# EAGLE design lipo (EAGLE 9.6.2)
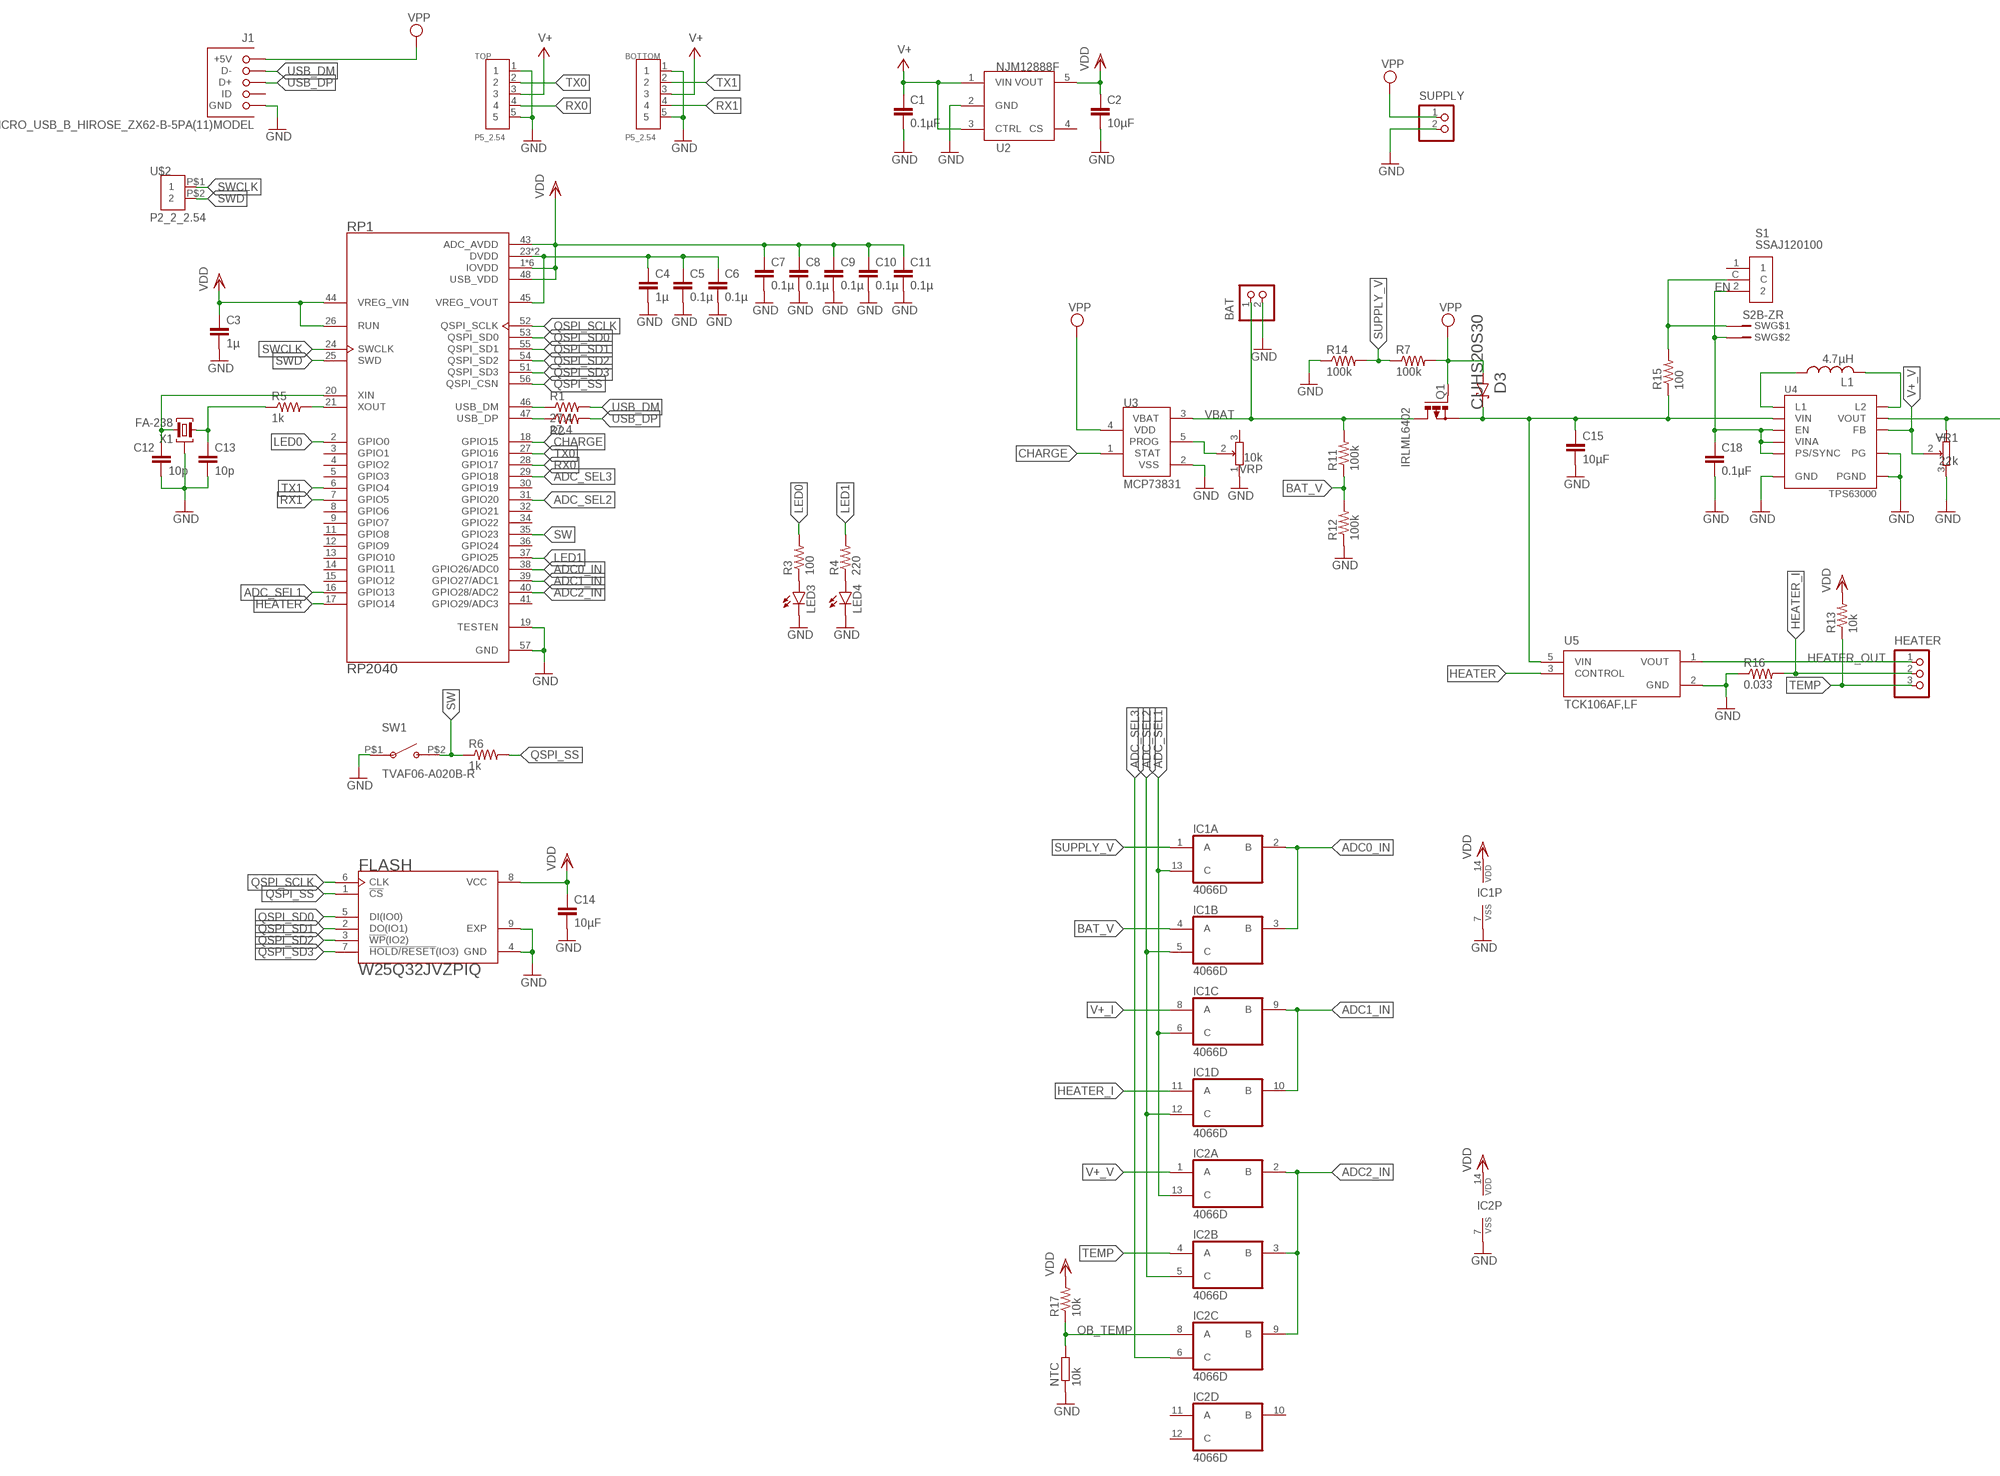
[diagram p0: schematic, sheet 1, part 1 of 2]
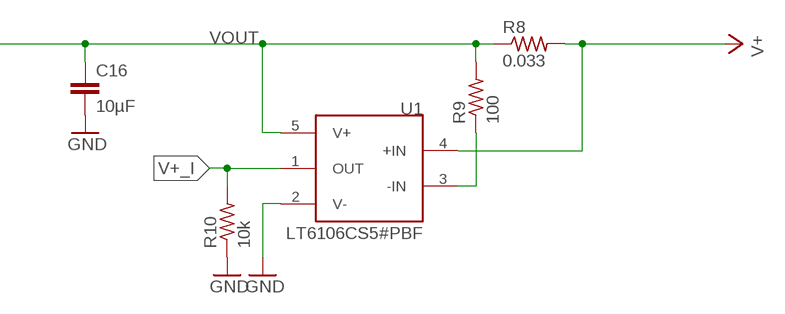
[diagram p1: schematic, sheet 1, part 2 of 2]

## Parts
BAT  S2B-PH-K-S  [S2B-PH-K-S]
BOTTOM  P5_2.54  [P5_2.54]
C1  0.1µF  C-EUC0402  [C0402]
C2  10µF  C-EUC0402  [C0402]
C3  1µ  C-EUC0402  [C0402]
C4  1µ  C-EUC0402  [C0402]
C5  0.1µ  C-EUC0402  [C0402]
C6  0.1µ  C-EUC0402  [C0402]
C7  0.1µ  C-EUC0402  [C0402]
C8  0.1µ  C-EUC0402  [C0402]
C9  0.1µ  C-EUC0402  [C0402]
C10  0.1µ  C-EUC0402  [C0402]
C11  0.1µ  C-EUC0402  [C0402]
C12  10p  C-EUC0402  [C0402]
C13  10p  C-EUC0402  [C0402]
C14  10µF  C-EUC0402  [C0402]
C15  10µF  C-EUC0402  [C0402]
C16  10µF  C-EUC0402  [C0402]
C18  0.1µF  C-EUC0402  [C0402]
D3  CUHS20S30  [CUHS20S30]
FLASH  W25Q32JVZPIQ  [SON127P600X500X80-9N]
HEATER  S3B-PH-K-S  [S3B-PH-K-S]
IC1  4066D  [SO14]
IC2  4066D  [SO14]
J1  MICRO_USB_B_HIROSE_ZX62-B-5PA(11)MODEL  [GHI-CONNECTORS_10118192-0001LF(MICRO-USB-B-AMPHENOL-FCI)]
L1  4.7µH  L-USL3225M  [L3225M]
LED3  LEDCHIPLED_0603  [CHIPLED_0603]
LED4  LEDCHIPLED_0603  [CHIPLED_0603]
NTC  10k  R-EU_R0603  [R0603]
Q1  IRLML6402  [SOT-23]
R1  27.4  R-US_R0402  [R0402]
R2  27.4  R-US_R0402  [R0402]
R3  100  R-US_R0402  [R0402]
R4  220  R-US_R0402  [R0402]
R5  1k  R-US_R0402  [R0402]
R6  1k  R-US_R0402  [R0402]
R7  100k  R-US_R0402  [R0402]
R8  0.033  R-US_R0603  [R0603]
R9  100  R-US_R0402  [R0402]
R10  10k  R-US_R0402  [R0402]
R11  100k  R-US_R0402  [R0402]
R12  100k  R-US_R0402  [R0402]
R13  10k  R-US_R0402  [R0402]
R14  100k  R-US_R0402  [R0402]
R15  100  R-US_R0402  [R0402]
R16  0.033  R-US_R0603  [R0603]
R17  10k  R-US_R0402  [R0402]
RP1  RP2040  [QFN40P700X700X90-57N]
S1  SSAJ120100  [SSAJ120100]
SUPPLY  S2B-PH-K-S  [S2B-PH-K-S]
SW  S2B-ZR  [S2B-ZR]
SW1  TVAF06-A020B-R  [TVAF06-A020B-R]
TOP  P5_2.54  [P5_2.54]
U1  LT6106CS5#PBF  [SOT95P280X100-5N_LT6106CS5#PBF]
U2  NJM12888F  [SOT95P240X110-5N]
U3  MCP73831  [SOT23-5L]
U4  TPS63000  [10-VFDFN]
U5  TCK106AF,LF  [IC_TCK106AF,LF]
U$2  P2_2_2.54  [P2_2.54]
VR1  22k  PVZ3A  [PVZ3A]
VRP  10k  PVZ3A  [PVZ3A]
X1  FA-238  [FA-238]

## Nets
1V2: C4.1 C5.1 C6.1 RP1.23(DVDD) RP1.45(VREG_VOUT) RP1.50(DVDD)
ADC0_IN: IC1.2(A:B) IC1.3(B:B) RP1.38(GPIO26/ADC0)
ADC1_IN: IC1.9(C:B) IC1.10(D:B) RP1.39(GPIO27/ADC1)
ADC2_IN: IC2.2(A:B) IC2.3(B:B) IC2.9(C:B) RP1.40(GPIO28/ADC2)
ADC_SEL1: IC1.6(C:C) IC1.13(A:C) IC2.13(A:C) RP1.16(GPIO13)
ADC_SEL2: IC1.5(B:C) IC1.12(D:C) IC2.5(B:C) RP1.31(GPIO20)
ADC_SEL3: IC2.6(C:C) RP1.29(GPIO18)
BAT_V: IC1.4(B:A) R11.1 R12.2
CHARGE: RP1.18(GPIO15) U3.1(STAT)
EN: C18.1 S1.2 SW.2 U4.6(EN) U4.7(PS/SYNC) U4.8(VINA)
GND: BAT.2 BOTTOM.1 BOTTOM.5 C1.2 C2.2 C3.2 C4.2 C5.2 C6.2 C7.2 C8.2 C9.2 C10.2 C11.2 C12.2 C13.2 C14.2 C15.2 C16.2 C18.2 FLASH.4(GND) FLASH.9(EXP) IC1.7(P:VSS) IC2.7(P:VSS) J1.CGND1(GND) J1.CGND2(GND) J1.CGND3(GND) J1.CGND4(GND) J1.CGND5(GND) J1.CGND6(GND) J1.GND LED3.C LED4.C NTC.1 R10.1 R12.1 R14.1 R16.1 RP1.19(TESTEN) RP1.57(GND) SUPPLY.2 SW1.P$1(A) TOP.1 TOP.5 U1.2(V-) U2.2(GND) U3.2(VSS) U4.3(PGND) U4.9(GND) U4.P$1(PG) U4.P$2(PG) U4.P$3(PG) U4.P$4(PG) U4.P$5(PG) U5.2(GND) VR1.3 VRP.1 X1.2(G) X1.4(G)
HEATER: RP1.17(GPIO14) U5.3(CONTROL)
HEATER_I: HEATER.2 IC1.11(D:A) R16.2
HEATER_OUT: HEATER.1 U5.1(VOUT)
LED0: R3.2 RP1.2(GPIO0)
LED1: R4.2 RP1.37(GPIO25)
N$1: L1.1 U4.4(L1)
N$2: R9.1 U1.3(-IN)
N$4: U3.5(PROG) VRP.2
N$7: L1.2 U4.2(L2)
N$8: LED3.A R3.1
N$9: LED4.A R4.1
N$11: C13.1 R5.1 X1.1
N$14: R15.2 S1.C SW.1
OB_TEMP: IC2.8(C:A) NTC.2 R17.1
QSPI_SCLK: FLASH.6(CLK) RP1.52(QSPI_SCLK)
QSPI_SD0: FLASH.5(DI(IO0)) RP1.53(QSPI_SD0)
QSPI_SD1: FLASH.2(DO(IO1)) RP1.55(QSPI_SD1)
QSPI_SD2: FLASH.3(!WP!(IO2)) RP1.54(QSPI_SD2)
QSPI_SD3: FLASH.7(!HOLD/RESET!(IO3)) RP1.51(QSPI_SD3)
QSPI_SS: FLASH.1(!CS) R6.2 RP1.56(QSPI_CSN)
RX0: RP1.28(GPIO17) TOP.4
RX1: BOTTOM.4 RP1.7(GPIO5)
SUPPLY_V: IC1.1(A:A) R7.1 R14.2
SW: R6.1 RP1.35(GPIO23) SW1.P$2(B)
SWCLK: RP1.24(SWCLK) U$2.P$1
SWD: RP1.25(SWD) U$2.P$2
TEMP: HEATER.3 IC2.4(B:A) R13.1
TX0: RP1.27(GPIO16) TOP.2
TX1: BOTTOM.2 RP1.6(GPIO4)
USB_DM: J1.D- R1.2
USB_DM_1: R1.1 RP1.46(USB_DM)
USB_DP: J1.D+ R2.2
USB_DP_1: R2.1 RP1.47(USB_DP)
V+: BOTTOM.3 C1.1 R8.2 TOP.3 U1.4(+IN) U2.1(VIN) U2.3(CTRL)
V+_I: IC1.8(C:A) R10.2 U1.1(OUT)
V+_V: IC2.1(A:A) U4.10(FB) VR1.2
VBAT: BAT.1 Q1.P3(D) R11.2 U3.3(VBAT)
VBAT_: C15.1 D3.C Q1.P2(S) R15.1 U4.5(VIN) U5.5(VIN)
VDD: C2.1 C3.1 C7.1 C8.1 C9.1 C10.1 C11.1 C14.1 FLASH.8(VCC) IC1.14(P:VDD) IC2.14(P:VDD) R13.2 R17.2 RP1.1(IOVDD) RP1.10(IOVDD) RP1.22(IOVDD) RP1.26(RUN) RP1.33(IOVDD) RP1.42(IOVDD) RP1.43(ADC_AVDD) RP1.44(VREG_VIN) RP1.48(USB_VDD) RP1.49(IOVDD) U2.5(VOUT)
VOUT: C16.1 R8.1 R9.2 U1.5(V+) U4.1(VOUT) VR1.1
VPP: D3.A J1.VBUS(+5V) Q1.P1(G) R7.2 SUPPLY.1 U3.4(VDD)
XIN1: C12.1 RP1.20(XIN) X1.3
XOUT1: R5.2 RP1.21(XOUT)
Unconnected: IC2.10(D:B) IC2.11(D:A) IC2.12(D:C) J1.ID RP1.3(GPIO1) RP1.4(GPIO2) RP1.5(GPIO3) RP1.8(GPIO6) RP1.9(GPIO7) RP1.11(GPIO8) RP1.12(GPIO9) RP1.13(GPIO10) RP1.14(GPIO11) RP1.15(GPIO12) RP1.30(GPIO19) RP1.32(GPIO21) RP1.34(GPIO22) RP1.36(GPIO24) RP1.41(GPIO29/ADC3) S1.1 U2.4(CS) VRP.3

## Library data of the parts
BAT SUPPLY = jst-ph:S2B-PH-*: Wire-to-Board 2.0mm pitch side mount connector Source: http://www.jst-mfg.com/product/pdf/jpn/PH.pdf http://www.jst-mfg.com/product/detail.php?series=199
BOTTOM TOP = pins:P5_2.54
C1-C16 C18 = rcl:C-EU: CAPACITOR, European symbol; SPICEPREFIX: C
D3 = diodes:CUHS20S30
FLASH = W25Q32JVZPIQ:W25Q32JVZPIQ: Serial Flash Memory With Dual, Quad Spi Check availability <https://pricing.snapeda.com/parts/W25Q32JVZPIQ/Winbond/view-part?ref=eda>; AVAILABILITY: In Stock; DESCRIPTION: FLASH - NOR Memory IC 32Mb (4M x 8) SPI - Quad I/O 133 MHz 8-WSON (6x5); MF: Winbond; MP: W25Q32JVZPIQ; PACKAGE: WSON-8 Winbond; PRICE: None; PURCHASE-URL: https://pricing.snapeda.com/search/part/W25Q32JVZPIQ/?ref=eda
HEATER = jst-ph:S3B-PH-*: Wire-to-Board 2.0mm pitch side mount connector Source: http://www.jst-mfg.com/product/pdf/jpn/PH.pdf http://www.jst-mfg.com/product/detail.php?series=199
IC1 IC2 = 40xx:4066: Quad bilateral ANALOG SWITCH
J1 = connector:MICRO_USB_B_HIROSE_ZX62-B-5PA(11): Connector Receptacle USB - micro B 2.0 5 Position Surface Mount, Right Angle, Horizontal Bottom Mount
L1 = rcl:L-US: INDUCTOR, American symbol; SPICEPREFIX: L
LED3 LED4 = led:LED: LED OSRAM: - CHIPLED LG R971, LG N971, LY N971, LG Q971, LY Q971, LO R971, LY R971 LH N974, LH R974 LS Q976, LO Q976, LY Q976 LO Q996 - Hyper CHIPLED LW Q18S LB Q993, LB Q99A, LB R99A - SideLED LS A670, LO A670, LY A670, LG A670, LP A670 LB A673, LV A673, LT A673, LW A673 LH A674 LY A675 LS A676, LA A676, LO A676, LY A676, LW A676 LS A679, LY A679, LG A679 - Hyper Micro SIDELED® LS Y876, LA Y876, LO Y876, LY Y876 LT Y87S - SmartLED LW L88C, LW L88S LB L89C, LB L89S, LG L890 LS L89K, LO L89K, LY L89K LS L896, LA L896, LO L896, LY L896 - TOPLED LS T670, LO T670, LY T670, LG T670, LP T670 LSG T670, LSP T670, LSY T670, LOP T670, LYG T670 LG T671, LOG T671, LSG T671 LB T673, LV T673, LT T673, LW T673 LH T674 LS T676, LA T676, LO T676, LY T676, LB T676, LH T676, LSB T676, LW T676 LB T67C, LV T67C, LT T67C, LS T67K, LO T67K, LY T67K, LW E67C LS E67B, LA E67B, LO E67B, LY E67B, LB E67C, LV E67C, LT E67C LW T67C LS T679, LY T679, LG T679 LS T770, LO T770, LY T770, LG T770, LP T770 LB T773, LV T773, LT T773, LW T773 LH T774 LS E675, LA E675, LY E675, LS T675 LS T776, LA T776, LO T776, LY T776, LB T776 LHGB T686 LT T68C, LB T68C - Hyper Mini TOPLED® LB M676 - Mini TOPLED Santana® LG M470 LS M47K, LO M47K, LY M47K Source: http://www.osram.convergy.de LUXEON: - LUMILED® LXK2-PW12-R00, LXK2-PW12-S00, LXK2-PW14-U00, LXK2-PW14-V00 LXK2-PM12-R00, LXK2-PM12-S00, LXK2-PM14-U00 LXK2-PE12-Q00, LXK2-PE12-R00, LXK2-PE12-S00, LXK2-PE14-T00, LXK2-PE14-U00 LXK2-PB12-K00, LXK2-PB12-L00, LXK2-PB12-M00, LXK2-PB14-N00, LXK2-PB14-P00, LXK2-PB14-Q00 LXK2-PR12-L00, LXK2-PR12-M00, LXK2-PR14-Q00, LXK2-PR14-R00 LXK2-PD12-Q00, LXK2-PD12-R00, LXK2-PD12-S00 LXK2-PH12-R00, LXK2-PH12-S00 LXK2-PL12-P00, LXK2-PL12-Q00, LXK2-PL12-R00 Source: www.luxeon.com KINGBRIGHT: KA-3528ASYC Source: www.kingbright.com
NTC = rcl:R-EU_: RESISTOR, European symbol; SPICEPREFIX: R
Q1 = mosfet:IRLML6402: Pch MOSFET IRLML6402 20V 3.7A http://akizukidenshi.com/catalog/g/gI-02553/ I-02553
R1-R17 = rcl:R-US_: RESISTOR, American symbol; SPICEPREFIX: R
RP1 = RP2040:RP2040: Check availability <https://pricing.snapeda.com/parts/RP2040/Raspberry%20Pi/view-part?ref=eda>; AVAILABILITY: In Stock; DESCRIPTION: RP2040 chip for Raspberry Pi Pico - ARM® Cortex®-M0+ MCU 32-Bit; MF: Raspberry Pi; MP: RP2040; PACKAGE: None; PRICE: None; PURCHASE-URL: https://pricing.snapeda.com/search/part/RP2040/?ref=eda
S1 = SSAJ120100:SSAJ120100: Slide Switches 1-pole 2-positions Surface Mount Slide Switch SPDT Maintained 10 mA Slide Source: Datasheet <http://www.farnell.com/datasheets/1582290.pdf>; DESCRIPTION: Slide Switches 1-pole 2-positions Surface Mount Slide Switch SPDT Maintained 10 mA Slide; HEIGHT: mm; MANUFACTURER_NAME: ALPS; MANUFACTURER_PART_NUMBER: SSAJ120100; MOUSER_PART_NUMBER: 688-SSAJ120100; MOUSER_PRICE-STOCK: https://www.mouser.com/Search/Refine.aspx?Keyword=688-SSAJ120100; RS_PART_NUMBER: 1238892; RS_PRICE-STOCK: http://uk.rs-online.com/web/p/products/1238892
SW = con-jst-zh:S2B-ZR
SW1 = switches:TVAF06-A020B-R
U1 = LT6106CS5_PBF:LT6106CS5#PBF: IC OPAMP CURR SENSE TSOT23-5 Check availability <https://pricing.snapeda.com/parts/LT6106CS5%23PBF/Linear%20Technology/view-part?ref=eda>; AVAILABILITY: Not in stock; DESCRIPTION: LT6106 - Low Cost, 36V High Side Current Sense Amplifier; MF: Linear Technology; MP: LT6106CS5#PBF; PACKAGE: TSOT-23 Linear Technology; PRICE: None
U2 = regulators:NJM12888F
U3 = mcp73831:MCP73831: Miniature Single-Cell, Fully Integrated Li-Ion, Li-Polymer Charge Management Controllers
U4 = TPS63000:TPS63000: Check availability <https://pricing.snapeda.com/parts/TPS63000/Texas%20Instruments/view-part?ref=eda>; AVAILABILITY: Not in stock; DESCRIPTION: TPS63000 DC to DC Converter and Switching Regulator Chip 3.2VDC to 3.4VDC Output Evaluation Board; MF: Texas Instruments; MP: TPS63000; PACKAGE: VFDFN-10 Texas Instruments; PRICE: None
U5 = TCK106AF_LF:TCK106AF,LF: Power Switch/Driver 1:1 P-Channel 1A 5-SMV, SOT-25, SC-74A Check availability <https://pricing.snapeda.com/parts/TCK106AF%2CLF/Toshiba%20Semiconductor/view-part?ref=eda>; AVAILABILITY: In Stock; DESCRIPTION: Power Switch/Driver 1:1 P-Channel 1A 5-SMV, SOT-25, SC-74A; MF: Toshiba Semiconductor; MP: TCK106AF,LF; PACKAGE: SOT-753 Toshiba Semiconductor; PRICE: None; PURCHASE-URL: https://pricing.snapeda.com/search/part/TCK106AF,LF/?ref=eda
U$2 = pins:P2_2_2.54
VR1 VRP = potentiometers:PVZ3A
X1 = crystal':FA-238: CRYSTAL

## Board
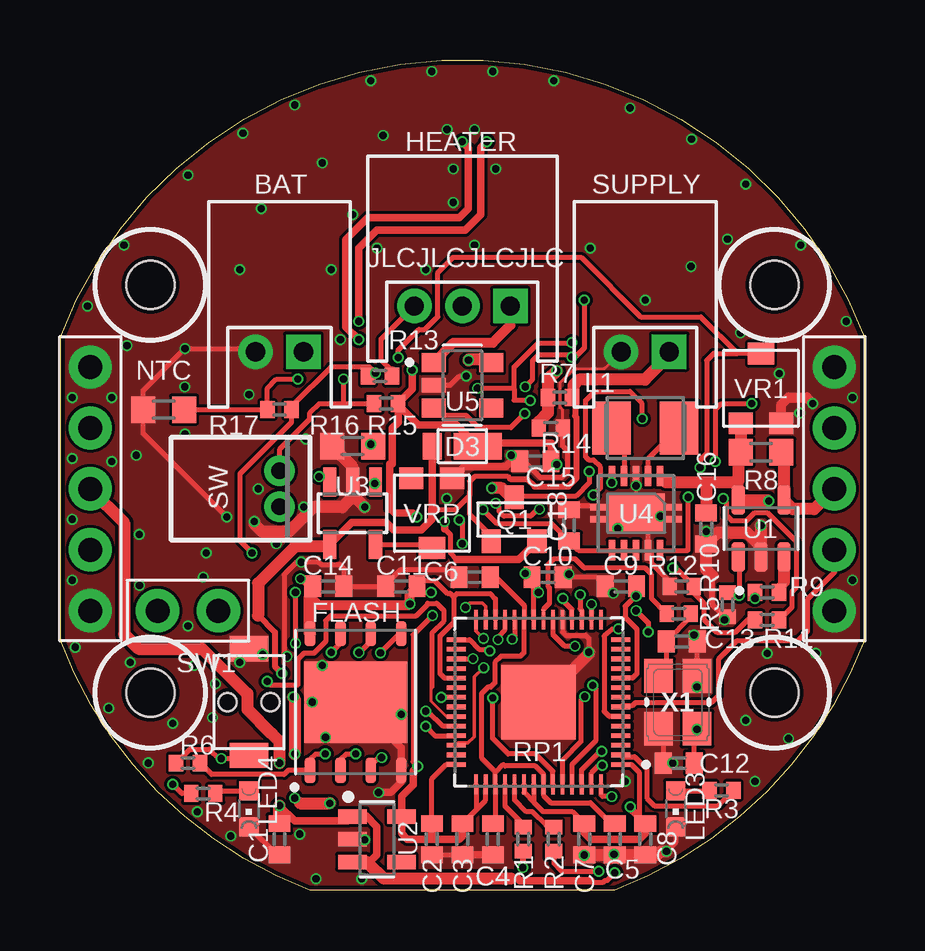
[diagram p2: board, top side]
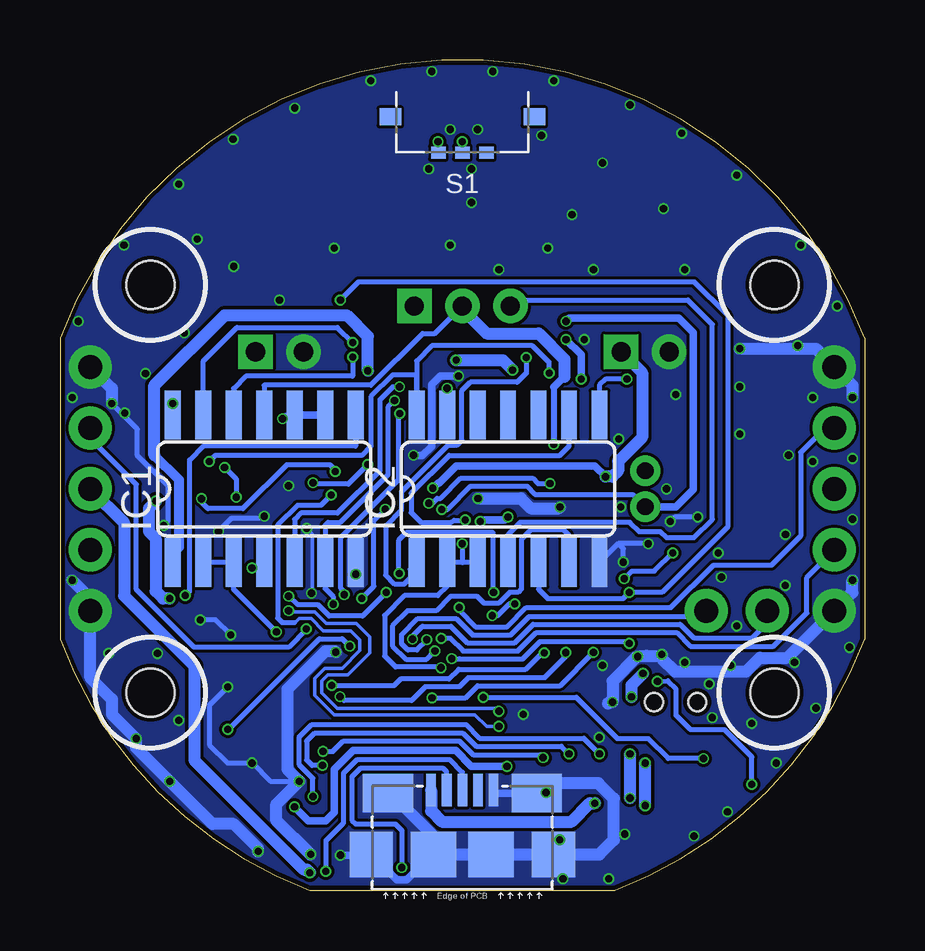
[diagram p3: board, bottom side, seen from below]

Size 33.53 x 34.61 mm. Coordinates in mm from the lower left corner, seen from the top.
Outline: 33.53,23.01 33.53,10.46 arc-49 23.11,0 10.41,0 arc-49 0,10.46 0,23.01 arc-139 33.53,23.01
Copper layers (1*16): Top 0.035mm / dielectric 1mm / Bottom 0.035mm
Design rules "jlcpcb-2layers-1.0mm": minimum track width 5mil, minimum drill 0.3mm, track to track 5mil, track to pad 5mil, pad to pad 5mil, via to via 5mil, smd to smd 5mil, copper to edge 0.2mm, drill to drill 6mil, minimum pad ring 10mil, minimum via ring 3mil, stop-mask expansion 4mil, vias tented up to drill 1mm, thermal gap 10mil
Holes 2 mm at 29.76,25.24 29.76,8.24 3.76,25.24 3.76,8.24

### Footprints (pad centres in the part's own frame; a part is rotated, then mirrored left to right if it is on the bottom)
S2B-PH-K-S = drill 0.8 square: 1 1,0 | drill 0.8: 2 -1,0
P5_2.54 = drill 1: 1 0,5.08; 2 0,2.54; 3 0,0; 4 0,-2.54; 5 0,-5.08
C0402 = smd 0.7 x 0.9: 1 -0.65,0; 2 0.65,0
CUHS20S30 = smd 0.8 x 1.1: A 1.25,0 | smd 2 x 1.1: C -0.65,0
SON127P600X500X80-9N = smd 1.04 x 0.44: 1 -2.845,1.905; 2 -2.845,0.635; 3 -2.845,-0.635; 4 -2.845,-1.905; 5 2.845,-1.905; 6 2.845,-0.635; 7 2.845,0.635; 8 2.845,1.905 | smd 3.4 x 4.3: 9 0,0
S3B-PH-K-S = drill 0.8 square: 1 2,0 | drill 0.8: 2 0,0; 3 -2,0
SO14 = smd 0.66 x 2.032: 1 -3.81,-3.073; 2 -2.54,-3.073; 3 -1.27,-3.073; 4 0,-3.073; 5 1.27,-3.073; 6 2.54,-3.073; 7 3.81,-3.073; 8 3.81,3.073; 9 2.54,3.073; 10 1.27,3.073; 11 0,3.073; 12 -1.27,3.073; 13 -2.54,3.073; 14 -3.81,3.073
GHI-CONNECTORS_10118192-0001LF(MICRO-USB-B-AMPHENOL-FCI) = smd 1.8 x 1.9: CGND1 -3.8,0; CGND4 3.8,0 | smd 1.9 x 1.9: CGND2 -1.2,0; CGND3 1.2,0 | smd 2.1 x 1.6: CGND5 3.1,2.55; CGND6 -3.1,2.55 | smd 0.4 x 1.35: D+ 0,2.675; D- -0.65,2.675; GND 1.3,2.675; ID 0.65,2.675; VBUS -1.3,2.675
L3225M = smd 1.6 x 2.2: 1 -1.4,0; 2 1.4,0
CHIPLED_0603 = smd 0.8 x 0.8: A 0,-0.75; C 0,0.75
R0603 = smd 1 x 1.1: 1 -0.85,0; 2 0.85,0
SOT-23 = smd 0.802 x 0.972: P1 -0.95,-0.917; P2 0.95,-0.917; P3 0,0.917
R0402 = smd 0.6 x 0.7: 1 -0.5,0; 2 0.5,0
QFN40P700X700X90-57N = smd 0.84 x 0.2: 1 -3.435,2.6; 2 -3.435,2.2; 3 -3.435,1.8; 4 -3.435,1.4; 5 -3.435,1; 6 -3.435,0.6; 7 -3.435,0.2; 8 -3.435,-0.2; 9 -3.435,-0.6; 10 -3.435,-1; 11 -3.435,-1.4; 12 -3.435,-1.8; 13 -3.435,-2.2; 14 -3.435,-2.6; 29 3.435,-2.6; 30 3.435,-2.2; 31 3.435,-1.8; 32 3.435,-1.4; 33 3.435,-1; 34 3.435,-0.6; 35 3.435,-0.2; 36 3.435,0.2; 37 3.435,0.6; 38 3.435,1; 39 3.435,1.4; 40 3.435,1.8; 41 3.435,2.2; 42 3.435,2.6 | smd 0.2 x 0.84: 15 -2.6,-3.435; 16 -2.2,-3.435; 17 -1.8,-3.435; 18 -1.4,-3.435; 19 -1,-3.435; 20 -0.6,-3.435; 21 -0.2,-3.435; 22 0.2,-3.435; 23 0.6,-3.435; 24 1,-3.435; 25 1.4,-3.435; 26 1.8,-3.435; 27 2.2,-3.435; 28 2.6,-3.435; 43 2.6,3.435; 44 2.2,3.435; 45 1.8,3.435; 46 1.4,3.435; 47 1,3.435; 48 0.6,3.435; 49 0.2,3.435; 50 -0.2,3.435; 51 -0.6,3.435; 52 -1,3.435; 53 -1.4,3.435; 54 -1.8,3.435; 55 -2.2,3.435; 56 -2.6,3.435 | smd 3.1 x 3.1: 57 0,0
SSAJ120100 = smd 0.6 x 0.51: 1 -1,2.5; 2 1,2.5; C 0,2.5 | smd 0.9 x 0.7: GND@1 -3,1; GND@2 3,1
S2B-ZR = drill 0.7 pad 1.1: 1 -0.75,0; 2 0.75,0
TVAF06-A020B-R = smd 1.6 x 1.05: P$1 0,2.225; P$2 0,-2.225 | hole 0.75: -0.9,0; 0.9,0
SOT95P280X100-5N_LT6106CS5#PBF = smd 1.24 x 0.55: 1 -1.185,0.95; 2 -1.185,0; 3 -1.185,-0.95; 4 1.185,-0.95; 5 1.185,0.95
SOT95P240X110-5N = smd 1.18 x 0.609: 1 -1.024,0.95; 2 -1.024,0; 3 -1.024,-0.95; 4 1.024,-0.95; 5 1.024,0.95
SOT23-5L = smd 0.533 x 1.2: 1 -0.95,-1.3; 2 0,-1.3; 3 0.95,-1.3 | smd 0.55 x 1.2: 4 0.95,1.3; 5 -0.95,1.3
10-VFDFN = smd 0.85 x 0.28: 1 -1.55,1; 2 -1.55,0.5; 3 -1.55,0; 4 -1.55,-0.5; 5 -1.55,-1; 6 1.55,-1; 7 1.55,-0.5; 8 1.55,0; 9 1.55,0.5; 10 1.55,1 | smd 1.65 x 2.4: P$1 0,0 | smd 0.28 x 0.7: P$2 -0.25,1.55; P$3 0.25,1.55; P$4 -0.25,-1.55; P$5 0.25,-1.55
IC_TCK106AF,LF = smd 1 x 0.8: 1 -1.2,0.95; 3 -1.2,-0.95; 4 1.2,-0.95; 5 1.2,0.95 | smd 1 x 0.6: 2 -1.2,0
P2_2.54 = drill 1: P$1 0,1.27; P$2 0,-1.27
PVZ3A = smd 1 x 0.9: 1 -0.85,-1.45; 3 0.85,-1.45 | smd 1.1 x 0.9: 2 0,1.45
FA-238 = smd 1.4 x 1.2: 1 -1.1,-0.8; 2 1.1,-0.8; 3 1.1,0.8; 4 -1.1,0.8

### Placement (x,y rotation side)
BAT  9.14,22.45 0 top
BOTTOM  32.26,16.74 0 top
C1  9.14,2.13 270 top
C2  15.49,2.13 270 top
C3  16.76,2.13 270 top
C4  18.03,2.13 270 top
C5  23.11,2.13 270 top
C6  17.27,13.05 180 top
C7  21.84,2.13 270 top
C8  24.38,2.13 270 top
C9  23.37,12.67 180 top
C10  20.32,13.05 0 top
C11  14.22,12.67 180 top
C12  25.78,5.31 180 top
C13  25.91,10.37 0 top
C14  11.18,12.67 0 top
C15  19.81,17.88 180 top
C16  26.92,15.08 270 top
C18  21.21,15.21 90 top
D3  16.76,18.51 180 top
FLASH  12.32,7.85 90 top
HEATER  16.76,24.36 0 top
IC1  25.02,16.74 0 bottom
IC2  14.86,16.74 0 bottom
J1  16.76,1.5 0 bottom
L1  24.38,19.28 0 top
LED3  25.65,3.4 180 top
LED4  7.87,3.4 180 top
NTC  4.32,20.04 0 top
Q1  18.92,15.47 0 top
R1  19.3,2.13 270 top
R2  20.57,2.13 270 top
R3  27.56,4.16 0 top
R4  5.97,4.04 180 top
R5  25.78,11.53 180 top
R6  5.33,5.31 0 top
R7  20.83,20.55 0 top
R8  29.21,18.26 0 top
R9  29.46,12.42 180 top
R10  27.81,11.91 90 top
R11  29.46,11.27 0 top
R12  25.91,12.67 0 top
R13  13.33,21.43 180 top
R14  20.45,19.28 180 top
R15  13.59,20.29 180 top
R16  12.19,18.51 0 top
R17  9.14,20.04 0 top
RP1  19.94,7.85 180 top
S1  16.76,33.25 180 bottom
SUPPLY  24.38,22.45 0 top
SW  9.14,16.74 270 top
SW1  7.87,7.85 0 top
TOP  1.26,16.74 0 top
U1  29.21,15.08 90 top
U2  13.21,2.13 0 top
U3  12.19,15.72 180 top
U4  24,15.72 270 top
U5  16.76,21.05 0 top
U$2  5.33,11.66 90 top
VR1  29.21,20.93 0 top
VRP  15.49,15.72 180 top
X1  25.74,7.84 270 top

### Tracks (layer width: path | path; a pad name or v marks a point on that pad's centre or on a via)
1V2
  Top 0.2: C4.1 18.14,2.89 RP1.45 18.14,4.9 18.16,4.92 | C5.1 22.97,2.78 22.1,3.65 20.45,3.65 20.14,3.96 RP1.50 20.14,4.85 19.81,5.18 18.54,5.18 18.48,5.24 18.16,4.92 | 18.16,4.92 17.56,5.53 17.56,8.2 17.84,8.48 17.96,8.48 18.12,8.64 18.12,9.49 18.38,9.75 19.18,9.75 19.34,9.91 RP1.23 19.34,11.88 18.16,13.05 C6.1
ADC0_IN  (via drill 0.3)
  Top 0.127: v24,11.66 24.13,11.53
  Top 0.2: 24.13,11.53 24.51,11.15 v24.51,10.77 | RP1.38 15.94,6.86 15.33,7.46 v15.24,7.46
  Bottom 0.15: v24,11.66 23.95,11.6 22.92,11.6 22.44,11.13 21.19,11.13 20.62,10.56
  Bottom 0.152: v15.24,7.46 15.37,7.59 21.98,7.59 22.63,8.24 22.63,8.72 22.38,8.98 21.54,8.98 20.62,9.9 20.62,10.56
  Bottom 0.2: IC1.2 IC1.3 26.29,12.54 v24.51,10.77
ADC1_IN  (via drill 0.3, 0.3 pad 0.2)
  Top 0.2: v22.23,16.48 22.53,16.79 22.53,17.64 22.23,17.94 22.04,17.94 21.91,18.07 21.91,20.42 22.29,20.8 23.75,20.8 24.26,20.29 v24.26,19.66 | v15.24,6.83 15.62,6.45 RP1.39
  Bottom 0.15: 23.75,11.15 23.57,11.33 23.06,11.33 22.55,10.81 21.41,10.81
  Bottom 0.152: v15.24,6.83 15.76,6.83 16.24,7.31 22.1,7.31 22.91,8.12 22.91,8.84 22.49,9.26 21.77,9.26 21.03,10 21.03,10.43 21.41,10.81
  Bottom 0.2: IC1.10 24.11,19.81 v24.26,19.66 | 23.75,11.15 24.26,11.15 24.46,11.35 24.46,15.22 23.63,16.05 22.66,16.05 v22.23,16.48
  Bottom 0.305: IC1.9 IC1.10
ADC2_IN  (via drill 0.3)
  Top 0.152: RP1.40 16.6,6.14 16.99,6.14 17.25,6.4 17.25,8.9 17.27,8.9 v17.65,9.28
  Top 0.2: v16.64,15.44 16.76,15.31 v16.76,14.45
  Bottom 0.2: IC2.3 16.76,13.66 | 16.76,13.66 IC2.2 | 17.4,13.01 IC2.2 | v17.65,9.28 17.68,9.3 19.54,9.3 20,9.76 20,11.47 19.18,12.29 17.78,12.29 17.4,12.67 IC2.2 | v16.64,15.44 16.66,15.42 17.11,15.42 17.23,15.34 18.48,15.34 18.89,15.75 18.89,16.55 17.31,18.13 12.7,18.13 12.32,18.51 IC2.9 | v16.76,14.45 16.76,13.66
ADC_SEL1  (via drill 0.3)
  Top 0.2: 18.92,20.93 v17.4,20.93 | 18.92,20.93 18.92,21.82 19.91,22.8 21.31,22.8 v21.34,22.83 | 18.92,20.93 18.92,20.42 v19.59,20.42 | v22.15,11.92 22.13,11.92 22.13,11.29 RP1.16
  Bottom 0.2: IC1.13 27.56,22.07 26.16,23.47 21.97,23.47 v21.34,22.83 | v17.4,20.93 IC2.13 | v22.15,11.92 22.15,12.24 22.48,12.58 IC1.6 22.48,15.21 22.35,15.34 21.84,15.34 19.87,17.32 19.87,20.14 v19.59,20.42
ADC_SEL2  (via drill 0.3)
  Top 0.2: v21.84,24.61 21.84,22.61 21.46,22.23 v21.34,22.23 v21.33,22.23 21.24,22.32 19.94,22.32 19.68,22.07 19.68,21.29 v19.38,20.99 | RP1.31 17.2,9.65 v17.21,9.66 | v9.81,12.42 v9.81,10.29
  Bottom 0.2: v21.34,22.23 21.34,21.44 21.34,21.43 25.78,21.43 26.29,20.93 IC1.12 | v19.38,20.99 19.66,20.99 20.19,20.46 20.19,17.5 21.97,15.72 23.49,15.72 23.75,15.47 IC1.5 | IC2.5 13.59,12.54 13.21,12.16 10.06,12.16 v9.81,12.42 8.44,12.42 5.71,15.14 5.71,23.97 7.11,25.37 21.08,25.37 v21.84,24.61 | v17.21,9.66 16.88,9.66 16.87,9.65 14.25,9.65 13.53,10.37 9.89,10.37 v9.81,10.29
ADC_SEL3  (via drill 0.3)
  Top 0.2: v17.91,9.97 17.83,10.05 17.46,10.05 17.06,10.45 RP1.29
  Bottom 0.2: IC2.6 12.32,14.79 12.54,15.01 13.92,15.01 14.3,14.63 14.3,12.55 14.43,12.42 14.79,12.42 15.25,11.96 15.86,11.96 16.14,12.24 17.28,12.24 17.86,11.66 19.04,11.66 19.68,11.02 19.68,10.2 19.11,9.63 18.25,9.63 v17.91,9.97
BAT_V  (via drill 0.3)
  Top 0.2: v25.53,13.43 25.65,13.43 R12.2 26.41,12.39 26.82,11.97 26.82,11.3 27.37,10.76 28.13,10.76 28.65,11.27 R11.1
  Bottom 0.2: IC1.4 25.25,13.43 v25.53,13.43
CHARGE  (via drill 0.3)
  Top 0.2: RP1.18 21.33,11.29 21.33,11.72 20.95,12.09 v20.95,12.16 | v19.98,15.88 19.89,15.88 19.61,15.6 18.49,15.6 18.29,15.8 18.29,15.98 18.16,16.11 v18.16,16.13 | U3.1 13.11,16.99 v13.11,16.95
  Bottom 0.2: v20.95,12.16 20.45,12.67 20.45,15.41 v19.98,15.88 | v18.16,16.13 18.01,16.13 17.81,16.33 17.67,16.33 16.83,17.18 13.84,17.18 13.62,16.95 v13.11,16.95
EN  (via drill 0.3)
  Top 0.2: U4.8 U4.7 U4.6 21.6,14.17 C18.1 20.49,15.28 18.22,15.28 v17.62,15.88
  Top 0.305: v12.45,23.72 12.45,26.77 13.21,27.53 16.89,27.53 17.53,28.17 17.53,30.96 v17.78,31.21
  Bottom 0.2: v17.78,31.21 17.78,30.76 S1.2 | v17.62,15.88 17.38,15.88 16.41,16.84 14.07,16.84 13.72,16.49 9.65,16.49 SW.2
  Bottom 0.305: SW.2 7.86,15.99 7.14,16.7 7.14,23.25 7.75,23.85 12.32,23.85 v12.45,23.72
GND  (via drill 0.3)
  Top 0.127: VRP.1 16.11,17.41 | R14.1 20.95,20.01 20.84,20.12 20.84,21.16 21.43,21.76 22.69,21.76 SUPPLY.2 | U3.2 12.19,16.48 | RP1.57 21.23,9.14 21.31,9.14
  Top 0.15: C9.2 23,12.39 v23.05,12.39 | U4.P$1 23.88,15.72 v23.24,15.08
  Top 0.152: U4.3 24,15.59 | U4.P$1 U4.3 | v24,16.86 U4.3 | 27.75,11.47 R10.1 v27.69,11.27 | C4.2 17.78,1.48
  Top 0.2: v21.21,13.18 21.1,13.18 C10.2 22.34,13.05 C9.2 | C6.2 16.38,13.05 16.08,13.35 14.18,13.35 13.57,12.75 C11.2 C14.2 11.83,13.42 11.65,13.59 10.87,13.59 10.79,13.68 v10.05,13.68 10.03,13.66 9.83,13.66 9.33,13.16 9.33,9.87 v9.46,9.74 | SW1.P$1 8.11,9.83 v8.45,9.83 | LED4.C 9.04,1.48 C1.2 | LED3.C 25.65,2 v25.27,1.62 | X1.2 25.13,6.55 C12.2 v25.53,5.31 | v26.54,8.48 X1.4 26.54,10.37 C13.2 26.42,10.53 v26.42,10.64 | RP1.19 20.94,10.76 21.07,10.63 21.9,10.63 22.04,10.5 v22.04,9.93 | R16.1 11.34,18.49 | C18.2 21.38,16.03 22.39,16.03 U4.P$4 23.88,15.97 24.13,15.72 | v25.02,15.59 24.89,15.72 24.13,15.72 | 24.13,15.72 U4.P$1 | U4.P$1 24.5,15.22 U4.9 24.64,14.04 24.64,13.65 25.41,12.88 R12.1 | 29.21,14.32 U1.2 | U4.P$5 23.88,15.47 24,15.59 24.13,15.72 | U4.P$2 24.25,15.97 U4.P$1 | U4.P$3 24.25,15.47 U4.P$1 | C5.2 23.09,1.48 v23.08,1.49 | U5.2 16.26,21.05 16.64,21.44 v16.93,21.44 | v18.8,18.13 18.8,18.08 18.78,18.06 18.78,17.88 | C15.2 19.34,17.88 20.02,17.2 20.91,17.2 21.15,17.45 21.15,18.31 20.95,18.51 R14.1 | v6.95,15.56 3.47,19.04 NTC.1 3.47,20.84 v5.21,22.58 8.02,22.58 BAT.2 | C2.2 C3.2 | v8.1,15.37 v9.02,14.45
  Top 0.254: 27.18,13.12 27.18,11.91 27.63,11.47 27.75,11.47
  Top 0.305: FLASH.9 14.22,5.94 FLASH.4 14.22,4.51 13.79,4.07 v13.27,4.07 | v12.7,2.1 12.21,2.1 U2.2 | C7.2 v21.84,1.46 | 17.78,1.48 C3.2 | VRP.1 16.85,17.67 18.57,17.67 18.78,17.88 C15.2
  Top 0.406: VR1.3 30.06,20.25 30.35,20.55 31.12,20.55 v31.37,20.29
  Top 0.508: v10.51,7.85 FLASH.9 | C7.2 C5.2 C8.2 24.89,1.48 25.04,1.62 v25.27,1.62 | v22.04,9.93 22.04,9.86 21.31,9.14 | 11.34,18.49 12.19,17.64 U3.2 12.24,16.97 12.24,16.45 11.77,15.97 10.56,15.97 9.53,14.94 8.43,14.94 8.1,15.28 v8.1,15.37 | v26.92,14.96 C16.2 | C16.2 27.4,14.91 28.62,14.91 29.21,14.32 | C16.2 26.92,13.38 27.18,13.12 | U1.2 v29.21,15.21 | 12.19,16.48 v12.7,15.98
  Bottom 0.15: v23.05,12.39 23.01,12.49 23.01,14.85 v23.24,15.08
  Bottom 0.2: J1.CGND2 17.65,1.5 | v23.55,4.54 24.77,4.54 v25.53,5.31 26.54,5.31 27.3,6.07 27.3,7.72 v26.54,8.48 | v26.42,10.64 27.05,11.27 v27.69,11.27 | v25.02,15.59 25.09,15.52 26.36,15.52 v26.92,14.96 | 13.72,4.05 J1.CGND5 13.3,4.05 v13.27,4.07 | v29.21,15.21 29.02,15.4 29.02,16.84 30.3,18.12 30.3,19.22 v31.37,20.29 | v6.95,15.56 7.91,15.56 v8.1,15.37 | v9.02,14.45 10.26,14.45 | 10.26,14.45 IC2.7 | IC1.7 v21.21,13.18 | v10.05,13.68 10.05,14.24 10.26,14.45
  Bottom 0.305: v12.7,2.1 12.7,1.76 J1.CGND4 | J1.GND 15.34,4.05 13.72,4.05 | v21.84,1.46 20.59,1.46 J1.CGND1 20.55,1.5 19.5,0.44 19.08,0.44 18.02,1.5 | v16.93,21.44 17.69,21.44 18.05,21.08 18.05,18.51 18.42,18.13 v18.8,18.13 | v16.93,21.44
  Bottom 0.508: J1.CGND6 19.75,4.05 17.96,2.26 J1.CGND2 18.02,1.5 | 17.65,1.5 J1.CGND3 J1.CGND4 11.05,1.5 10.45,2.1 10.45,3.81 11.09,4.46 13.25,4.46 J1.CGND5 | 10.7,7.78 10.63,7.85 v10.51,7.85 10.51,8.71 9.45,9.77 8.52,9.77 v8.45,9.83 | v25.27,1.62 25.27,1.74 26.3,2.77 27.18,2.77 v28.96,4.54 30.35,5.94 v30.35,6.32 31.37,7.34 31.37,7.97 32.26,8.86 BOTTOM.5 32.26,12.17 v33.02,12.93 | v23.08,1.49 v23.09,1.5 23.11,1.5 24.51,2.9 24.51,3.59 v23.55,4.54 24.06,5.05 24.06,8.38 22.46,9.98 22.09,9.98 v22.04,9.93 | v8.45,9.83 8.51,9.78 9.09,9.78 | BOTTOM.1 31.37,20.92 v31.37,20.29 | v0.51,20.55 0.51,21.06 TOP.1 2.03,22.58 v5.21,22.58 | v0.51,12.93 0.51,12.41 TOP.5 3.23,9.69 4.37,9.69 4.94,9.12 7.9,9.12 8.45,9.67 v8.45,9.83 | v16.11,16.34 14.32,16.34 13.91,15.92 12.75,15.92 v12.7,15.98
  other vias: 33.02,20.55 5.33,29.82 32.77,23.72 30.86,26.9 28.57,29.44 26.32,31.31 23.75,32.61 20.57,33.75 18.03,34.13 15.49,34.13 12.95,33.75 9.78,32.74 7.62,31.56 2.67,26.9 1.14,24.36 0.51,18.01 0.51,15.47 0.63,10.13 2.03,7.59 3.68,5.31 4.7,6.96 7.11,2.26 31.5,9.88 28.57,7.08 5.71,3.27 6.35,7.2 6.48,8.61 5.21,19.02 3.3,14.83 2.92,9.5 3.31,12.71 2.16,20.55 30.82,19.9 29.97,21.54 26.29,26.01 27.81,27.15 28.35,23.24 24.38,24.61 22.1,26.77 17.27,26.9 18.16,30.07 17.27,31.72 16.13,31.72 16.38,30.07 16.38,28.67 12.19,28.17 13.21,26.77 15.24,25.88 13.46,31.47 10.92,30.32 11.3,25.88 7.49,25.88 8.38,28.42 2.79,22.7 5.2,20.99 7.87,20.67 11.68,22.96 3.17,18.13 2.16,17.88 6.1,14.07 5.97,13.05 5.33,11.02 5.59,9.37 7.49,9.5 10.16,15.97 8.25,16.74 10.24,18.81 10.92,9.37 14.22,7.34 11.06,6.37 9.99,2.34 10.67,0.48 12.57,0.48 29.46,9.88
  pour Top (no thermals): -6.1,36.55 38.35,36.55 38.35,-3.58 -6.1,-3.58
  pour Bottom (no thermals): -7.37,37.18 42.16,37.18 42.16,-6.12 -7.37,-6.12
HEATER  (via drill 0.3)
  Top 0.2: U5.3 15.86,19.8 16.92,19.8 17.43,19.29 18.78,19.29 v19.37,19.87 | v21.68,12.32 21.68,11.74 21.74,11.68 RP1.17
  Bottom 0.2: v19.37,19.87 19.43,19.81 19.43,17.11 21.84,14.7 21.84,12.61 21.68,12.44 v21.68,12.32
HEATER_I  (via drill 0.3)
  Top 0.2: R16.2 v12.96,18.59 v12.95,18.59
  Bottom 0.2: IC1.11 25.02,21.05 20.57,21.05 18.41,23.21 17.91,23.21 HEATER.2 16.76,24.23
  Bottom 0.254: 12.95,20.97 v12.95,18.59
  Bottom 0.305: 12.51,21.41 12.95,20.97
  Bottom 0.508: 16.76,24.23 15.75,23.21 13.59,23.21 12.51,22.13 12.51,21.41
HEATER_OUT
  Top 0.406: U5.1 16.39,22.83 18.03,22.83 18.76,23.56 HEATER.1
LED0
  Top 0.2: RP1.2 23.45,5.57 23.94,5.57 24.46,5.06 24.46,3.84 24.77,3.52 27.42,3.52 R3.2
LED1  (via drill 0.3)
  Top 0.127: 15.49,8.48 15.47,8.46 15.47,7.87 16.1,7.25 RP1.37
  Top 0.2: 15.49,8.48 15.49,10.72 16,11.23 16,11.66 15.7,11.96 15.31,11.96 15.31,11.91 14.84,11.44 11.27,11.44 11.07,11.23 11.07,10.37 10.57,9.88 10.16,9.88 9.91,9.62 9.91,8.55 8.79,8.55 v8.64,8.71 | R4.2 5.08,4.04 v4.7,4.42
  Bottom 0.2: v4.7,4.42 4.7,5.56 5.84,6.7 7.27,6.7 7.85,7.29 7.85,8.39 8.2,8.73 v8.64,8.71
N$1
  Top 0.2: L1.1 23.5,18.76 U4.4
N$2
  Top 0.305: 30.16,12.87 29.96,12.67 R9.1
  Top 0.508: U1.3 30.16,12.87
N$4
  Top 0.2: U3.5 15.34,14.42 VRP.2
N$7
  Top 0.2: U4.2 24.5,17.99 L1.2
N$8
  Top 0.2: LED3.A 27.05,4.15 R3.1
N$9
  Top 0.2: R4.1 6.58,4.15 LED4.A
N$11
  Top 0.2: R5.1 26.28,11.41 C13.1 25.26,9.25 X1.1
N$14  (via drill 0.3)
  Top 0.2: SW.1 9.14,18.37 10.41,19.64 10.41,19.91 10.79,20.29 11.81,20.29 | 11.81,20.29 R15.2 | v11.81,21.31 11.81,20.29
  Top 0.305: v12.45,22.96 11.91,23.49 11.91,27.13 12.83,28.04 16.64,28.04 17.02,28.42 17.02,30.96 v16.76,31.21
  Bottom 0.2: v16.76,31.21 S1.C
  Bottom 0.305: v12.45,22.96 11.81,22.32 v11.81,21.31
OB_TEMP  (via drill 0.3)
  Top 0.2: NTC.2 8,20.04 R17.1 8.64,20.93 9.02,21.31 v9.91,21.31
  Bottom 0.2: v9.91,21.31 10.79,21.31 11.05,21.05 IC2.8
QSPI_SCLK  (via drill 0.3)
  Top 0.2: v12.45,9.91 12.5,9.91 12.95,10.37 FLASH.6 | v21.86,8.07 21.72,7.93 21.72,6.2 20.94,5.42 RP1.52
  Bottom 0.2: v12.45,9.91 12.45,9.74 13.32,8.87 16.5,8.87 16.89,8.48 18.31,8.48 18.88,7.91 21.7,7.91 v21.86,8.07
QSPI_SD0  (via drill 0.3)
  Top 0.2: RP1.53 21.34,5.25 22.32,6.23 22.32,8.43 v22.2,8.55 | FLASH.5 14.14,10.69 v13.35,9.9
  Bottom 0.2: v22.2,8.55 22.18,8.53 19.62,8.53 19.34,8.81 17.32,8.81 16.92,9.21 14.13,9.21 13.44,9.9 v13.35,9.9
QSPI_SD1  (via drill 0.3)
  Top 0.2: RP1.55 22.14,4.89 22.45,5.21 v22.59,5.21 | FLASH.2 11.68,5.43 11.94,5.69 v12.32,5.69
  Bottom 0.2: v22.59,5.21 23.02,5.21 23.25,5.43 23.25,6.22 22.91,6.56 16.75,6.56 16.19,6 12.63,6 v12.32,5.69
QSPI_SD2  (via drill 0.3)
  Top 0.2: RP1.54 21.74,5.02 22.51,5.79 v22.57,5.79 | FLASH.3 12.95,5.21 13.3,5.55 13.37,5.55 v13.4,5.53
  Bottom 0.2: v22.57,5.79 22.15,5.79 21.72,6.22 16.89,6.22 16.31,5.65 13.52,5.65 v13.4,5.53
QSPI_SD3  (via drill 0.3)
  Top 0.2: RP1.51 20.54,4.96 19.81,5.69 18.67,5.69 18.03,6.33 v18.03,8.03 | v11.3,9.91 11.68,10.29 FLASH.7
  Bottom 0.2: v18.03,8.03 16.63,8.03 16.12,8.52 12.69,8.52 v11.3,9.91
QSPI_SS  (via drill 0.3)
  Top 0.2: RP1.56 22.54,3.98 22.61,3.91 v22.99,3.91 | R6.2 6.31,4.82 9.34,4.82 9.52,5 FLASH.1 10.41,5.43 10.67,5.69 v11.05,5.69
  Bottom 0.2: v22.99,3.91 22.99,4.67 23.58,5.26 23.58,6.37 23.04,6.91 16.62,6.91 16.05,6.34 11.7,6.34 v11.05,5.69
RX0  (via drill 0.3)
  Top 0.152: RP1.28 17.34,10.82 17.33,10.82 v17.64,10.5
  Bottom 0.2: v17.64,10.5 17.26,10.5 16.73,9.97 14.45,9.97 13.68,10.75 7.84,10.75 7.26,10.17 3.8,10.17 2.41,11.56 2.41,13.04 TOP.4
RX1
  Top 0.2: RP1.7 23.45,7.72 23.87,7.72 23.98,7.83 27.15,7.83 27.43,8.11 27.43,9.62 28.19,10.39 30.73,10.39 31.14,10.79 31.14,12.12 32.26,13.25 BOTTOM.4
SUPPLY_V  (via drill 0.3)
  Top 0.508: R14.2 19.95,19.53 20.33,19.91 R7.1 20.33,21.28 v20.7,21.66
  Bottom 0.406: 28.83,14.04 28.57,14.3 28.57,17.12 29.59,18.13
  Bottom 0.508: IC1.1 28.83,14.04 | 29.59,18.13 29.59,21.05 26.67,23.97 21.59,23.97 20.7,23.09 v20.7,21.66
SW  (via drill 0.3)
  Top 0.2: R6.1 5.41,5.88 6.23,5.88 6.62,5.49 v6.71,5.49 7.74,5.49 SW1.P$2 | RP1.35 15.9,8.04 v15.89,8.05
  Bottom 0.2: v15.89,8.05 12.02,8.05 10.29,6.32 9.02,6.32 8.18,5.49 v6.71,5.49
SWCLK  (via drill 0.3)
  Top 0.2: RP1.24 18.94,10.56 v18.84,10.47
  Bottom 0.2: v18.84,10.47 18.84,10.59 18.43,11 17.25,11 16.56,10.31 14.59,10.31 13.81,11.09 7.69,11.09 7.13,10.53 4.68,10.53 4.06,11.15 U$2.P$1
SWD  (via drill 0.3)
  Top 0.2: RP1.25 18.53,10.85 18.25,10.57 v18.25,10.45
  Bottom 0.2: v18.25,10.45 18.25,10.41 18.65,10.01 19.03,10.01 19.29,10.28 19.29,10.65 18.62,11.33 17.03,11.33 16.34,10.64 14.75,10.64 13.98,11.41 6.85,11.41 U$2.P$2
TEMP
  Top 0.2: 13.83,21.64 13.37,22.11 13.37,22.96 HEATER.3
  Top 0.406: R13.1 13.83,21.64
  Bottom 0.2: IC2.4 14.86,14.83 14.35,15.34 9.78,15.34 9.4,14.96 8.51,14.96 8.25,14.7 7.11,14.7 6.35,15.47 6.35,23.59 7.37,24.61 14.51,24.61 HEATER.3
TX0  (via drill 0.3)
  Top 0.152: RP1.27 17.74,11.82 17.59,11.97 17.08,11.97 v16.9,11.79
  Bottom 0.2: v16.9,11.79 16.9,11.66 16.22,10.99 14.89,10.99 14.09,11.78 8.07,11.78 6.29,13.56 3.88,13.56 2.67,14.77 2.67,18.26 1.65,19.28 TOP.2
TX1  (via drill 0.3)
  Top 0.2: RP1.6 22.89,7.25 22.67,7.46 22.67,10.6 23.01,10.88 v23.27,10.9
  Bottom 0.2: v23.27,10.9 23.21,10.89 23.24,10.89 24,10.13 27.94,10.13 30.34,12.54 30.34,16.92 32.26,18.84 BOTTOM.2
USB_DM  (via drill 0.3)
  Top 0.254: R1.2 19.29,1.61 v19.29,0.95
  Bottom 0.2: J1.D- 17.41,4.94 17.55,5.08 21.02,5.08 21.37,4.74 21.37,2.93 21.21,2.77 19.56,2.77 19.29,2.49 v19.29,0.95
USB_DM_1
  Top 0.2: RP1.46 18.54,3.52 19.3,2.76 R1.1
USB_DP  (via drill 0.3)
  Top 0.2: v22.45,0.8 20.89,0.8 20.57,1.11 R2.2
  Bottom 0.2: J1.D+ 16.76,4.92 17.27,5.43 21.17,5.43 21.72,4.88 21.72,2.8 22.45,2.07 v22.45,0.8
USB_DP_1
  Top 0.2: R2.1 20.51,2.7 20.25,2.7 19.68,3.27 19.43,3.27 18.94,3.77 RP1.47
V+  (via drill 0.3)
  Top 0.2: v23.12,0.73 22.8,0.42 22.71,0.42 22.64,0.34 22.2,0.34 22.16,0.39 22.15,0.39
  Top 0.305: 18.8,0.49 19.06,0.49 19.17,0.39 22.15,0.39 | v9.14,3.53 9.78,2.89 11.99,2.89 U2.1 12.2,3.1 12.76,3.1 13.21,2.65 13.21,1.48 12.85,1.13 | R8.2 30.16,18.16
  Top 0.508: U2.3 12.8,1.18 12.85,1.13 13.49,0.49 18.8,0.49 | TOP.3 2.67,15.33 2.67,10.67 3.27,10.07 5.92,10.07 7.8,8.19 7.8,7.54 8.81,6.53 8.83,6.53 9.14,6.21 v9.14,5.31 | C1.1 v9.14,3.53 | 30.16,18.16 U1.4 30.54,15.89 31.42,15.89 BOTTOM.3
  Bottom 0.508: v23.12,0.73 23.24,0.86 23.37,0.86 27.93,5.42 27.93,9.35 30.86,12.28 30.86,15.33 BOTTOM.3 | v9.14,3.53 v9.14,5.31
V+_I  (via drill 0.3)
  Top 0.2: U1.1 28.3,13.86 v28.3,12.29
  Top 0.305: R10.2 27.94,12.29 v28.3,12.29
  Bottom 0.127: v28.3,12.29 28.13,12.46
  Bottom 0.2: IC1.8 21.21,18.51 27.56,18.51 28.13,17.94 28.13,12.46
V+_V  (via drill 0.3)
  Top 0.2: U4.10 26.16,14.17 26.16,16.37 v26.18,16.39 | VR1.2 28.23,22.38 | v26.67,17.62 26.67,17.94 26.94,18.21 26.94,22.08 27.23,22.38 28.23,22.38 | v14.1,22.2 14.07,22.22 14.07,22.5 14.95,23.37 15.21,23.37 15.75,23.92 15.75,25.75 | 28.23,22.38 26.71,23.91 24.2,23.91 21.72,26.39
  Top 0.203: 15.75,25.75 16.38,26.39 21.72,26.39
  Bottom 0.2: v26.18,16.39 26.18,17.14 v26.67,17.62 | IC2.1 18.94,13.39 18.94,13.02 19.2,12.76 19.58,12.76 19.96,13.14 19.96,15.19 19.3,15.85 19.3,16.61 17.35,18.57 16.97,18.57 16.78,18.76 16.78,20.82 16.43,21.18 14.48,21.18 14.1,21.56 v14.1,22.2
VBAT  (via drill 0.3)
  Top 0.2: v27.63,16.33 27.76,16.2 27.76,15.64 27.98,15.41 28.62,15.41 28.96,15.75 29.46,15.75 30.67,14.54 30.67,12.63 30.49,12.45 30.49,11.8 R11.2 | Q1.P3 18.98,16.44 21.5,16.44 22.05,16.99 v22.05,17.45
  Top 0.305: U3.3 11.24,17.05 11.05,17.24 v10.79,17.24
  Top 0.508: Q1.P3 18.8,16.38 18.41,16.76 v18,16.76 | v18,16.76
  Bottom 0.2: v22.05,17.45 22.05,17.51 22.29,17.74 22.48,17.74 24.06,17.75 25.9,15.91 27.37,15.91 27.63,16.17 v27.63,16.33
  Bottom 0.305: v18,16.76 17.77,16.98 17.72,16.98 17.02,17.69 11.24,17.69 v10.79,17.24
  Bottom 0.508: v10.79,17.24 10.51,17.24 10.27,17.48 10.27,17.88 9.27,18.88 9.27,21.58 BAT.1
VBAT_  (via drill 0.3)
  Top 0.127: 13.85,17.77 13.75,17.77
  Top 0.2: 17.54,18.64 D3.C 17.03,18.9 | U4.5 23,17.01 v22.99,16.99 | 16.54,13.78 16.27,14.05 16.27,14.81 16.02,15.06 | C15.1 20.59,17.75 v20.7,17.75
  Top 0.305: C15.1 20.46,18.64 17.54,18.64 | Q1.P2 19.11,13.78 16.54,13.78 | 16.02,15.06 v16.02,15.38 | R15.1 14.09,20.31 14.67,20.89 v14.67,21.69 | 17.03,18.9 16.54,19.39 14.93,19.39 14.09,20.23 R15.1 | 13.85,17.77 13.85,19.26 14.09,19.5 R15.1 | 13.75,17.77 13.75,15.91 13.94,15.72 14.7,15.72 v14.86,15.56
  Top 0.508: v17.02,22.1 17.05,22.13 17.84,22.13 U5.5
  Bottom 0.2: v20.7,17.75 21.52,16.93 22.93,16.93 v22.99,16.99
  Bottom 0.305: v14.86,15.56 14.99,15.44 16.01,15.44 16.02,15.42 v16.02,15.38
  Bottom 0.508: v17.02,22.1 15.08,22.1 v14.67,21.69
VDD  (via drill 0.3)
  Top 0.2: RP1.44 17.74,3.76 17.34,3.36 | 17.34,3.36 C3.1 | RP1.42 16.1,5.25 15.49,4.64 C2.1 | RP1.48 19.34,4.07 19.74,3.67 | 19.74,3.67 20.12,3.29 21.34,3.29 C7.1 | RP1.33 16.02,8.85 15.84,9.02 15.84,10.61 16.42,11.18 16.42,12.25 | RP1.43 17.34,3.36 | 10.41,12.25 10.41,12.56 C14.1 10.34,12.67 v10.02,12.99 | RP1.22 19.74,12.98 C10.1 | RP1.1 23.81,5.25 24.13,4.92 24.13,3.03 C8.1 | RP1.10 23.86,8.85 24.04,9.03 24.04,10.89 23.55,11.38 23.55,11.84 23.81,12.11 23.85,12.11 v24,12.26 | 14.87,12.64 C11.1 | v14.9,5.17 14.72,5.36 14.72,10.65 v15.52,11.45 | v14.58,11.94 14.51,11.87 | C10.1 19.67,13.21 v19.39,13.21 | RP1.49 19.74,3.67 | R13.2 12.96,21.56 v13.14,21.56 12.89,21.82 11.29,21.82 9.64,20.16 R17.2 9.64,19.51 7.49,17.36 7.49,14.58 v8,14.07 | v27.3,17.88 27.3,20.04 27.56,20.29 v28.83,20.29 | C10.1 19.67,12.69 v19.94,12.42 | C11.1 15.13,12.93 15.59,12.93 16.14,12.38 16.26,12.38 16.38,12.25 16.42,12.25 | C11.1 15.13,12.41 v15.46,12.41 | RP1.26 18.14,12.15 17.94,12.35 16.52,12.35 16.42,12.25
  Top 0.305: C3.1 16.76,2.26 16.64,2.13 15.49,2.13 | C2.1 15.49,2.13 | C7.1 21.85,2.39 22.11,2.13 24.13,2.13 24.38,2.38 C8.1 23.76,3.41 v23.76,3.47 | 15.49,2.13 14.48,2.13 14.23,2.38 U2.5 14.23,3.91 14.72,4.4 14.72,4.99 v14.9,5.17 | C9.1 24.02,12.27 v24,12.26
  Top 0.406: 10.41,12.25 10.79,11.87 14.51,11.87 | v14.58,11.94 14.58,12.35 14.87,12.64
  Top 0.508: FLASH.8 10.41,12.25
  Bottom 0.2: v14.58,11.94 14.8,11.94 15.29,11.45 v15.52,11.45 | v27.3,17.88 27.05,18.13 20.95,18.13 20.57,18.51 20.57,20.58 19.66,21.49 18.67,21.49 IC2.14 18.67,22.07 18.03,22.7 13.84,22.7 13.14,22.01 v13.14,21.56 | v19.39,13.21 19.43,13.25 19.43,14.58 19.1,14.91 15.49,14.91 15.49,12.45 v15.46,12.41 | v8,14.07 8.76,13.31 9.7,13.31 v10.02,12.99 | IC1.14 v28.83,20.29 | v19.94,12.42 20.92,11.43 22.32,11.43 22.79,11.91 23.62,11.91 23.97,12.26 v24,12.26
  Bottom 0.305: v14.9,5.17 16.39,5.17 17.05,5.83 21.31,5.83 22.1,5.04 22.1,4.67 22.1,3.26 22.46,2.89 23.18,2.89 v23.76,3.47
VOUT  (via drill 0.3)
  Top 0.152: R9.2 28.96,12.15 v28.96,12.16
  Top 0.2: R8.1 28.26,18.16 | U4.1 25.26,17.02 | 28.26,17.02 U1.5
  Top 0.305: 29.48,16.27 v29.53,16.23
  Top 0.508: VR1.1 R8.1 | U1.5 29.48,16.27 | 26.83,17.02 28.26,17.02 28.26,18.16 | C16.1 26.92,16.92 26.83,17.02 | 25.26,17.02 26.83,17.02
  Bottom 0.508: v29.53,16.23 29.83,15.93 29.83,14.96 29.55,14.68 29.55,12.48 29.23,12.16 v28.96,12.16
VPP  (via drill 0.3)
  Top 0.127: 21.46,21.12 21.46,20.93 21.33,20.8 R7.2 21.46,20.41 | 21.46,20.3 21.46,20.29
  Top 0.152: 21.46,20.29 21.46,19.78
  Top 0.2: Q1.P1 17.97,14.76 17.08,15.66 17.08,16.64 17.07,16.63 | v9.78,3.85 9.99,3.63 | 18.76,17.15 18.65,17.27 17.29,17.27 17.07,17.04 17.07,16.63 | 17.07,16.63 17.07,16.47 16.46,15.86 15.49,15.86
  Top 0.254: 8.25,11.45 8.95,10.75 8.95,9.33 v9.24,9.04 | 18.76,17.15 19.45,17.15 19.78,16.83 21.18,16.83 21.52,17.17 21.52,19.73 21.46,19.78 21.46,20.41
  Top 0.305: v11.24,3.63 | U3.4 12.16,15.34 13.59,15.34 13.91,15.02 15.05,15.02 15.49,15.46 15.49,15.86 15.49,15.92 15.51,15.94 D3.A
  Top 0.508: SUPPLY.1 25.38,22.31 24.37,21.29 21.63,21.29 21.46,21.12 21.39,21.06 21.39,20.48 | U3.4 11.17,14.34 9.8,14.34 8.25,12.8 8.25,11.45 | v9.72,8.06 9.78,8 v9.78,5.69 | 9.99,3.63 v11.24,3.63
  Bottom 0.508: J1.VBUS 18.06,3.3 17.62,2.86 12.21,2.86 11.45,3.63 v11.24,3.63 | v9.24,9.04 9.24,9.02 9.72,8.55 v9.72,8.06 | v9.78,5.69 v9.78,3.85
XIN1  (via drill 0.3)
  Top 0.2: RP1.20 20.54,10.67 21.04,10.18 v21.46,10.18 | C12.1 26.43,6.63 X1.3 v26.54,6.7
  Bottom 0.2: v26.54,6.7 26.5,6.7 22.72,10.49 21.77,10.49 v21.46,10.18
XOUT1
  Top 0.15: 20.14,11.71 RP1.21
  Top 0.2: R5.2 24.65,12.16 24.65,13.16 24.38,13.43 21.84,13.43 21.46,13.81 20.57,13.81 20.32,13.56 20.32,12.67 20.39,12.61 20.39,11.96 20.14,11.71

### Text on the board
tNames: JLCJLCJLCJLC
tStop: 2023 WASA Rocket
bStop: TERES LiPo Module